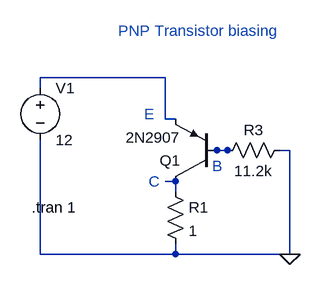
[diagram p0: schematic PNP-transistor-biasing.asc]
PNP-transistor-biasing.asc, the LTspice schematic file:
Version 4.1
SHEET 1 880 680
WIRE 192 208 192 224
WIRE 352 64 368 64
WIRE -16 48 -16 64
WIRE 192 224 368 224
WIRE 368 224 368 64
WIRE 192 224 -16 224
WIRE -16 224 -16 64
FLAG 368 224 0
WIRE 192 16 176 16
WIRE -16 -32 -16 -48
WIRE 176 16 176 -48
WIRE 176 -48 -16 -48
WIRE 256 64 272 64
WIRE 272 64 256 64
WIRE 192 112 176 112
WIRE 192 128 192 112
SYMBOL pnp 256 112 R180
SYMATTR InstName Q1
SYMATTR Value 2N2907
SYMBOL res 176 112 R0
SYMATTR InstName R1
SYMATTR Value 1
SYMBOL res 256 80 R270
WINDOW 0 32 56 VTop 2
WINDOW 3 0 56 VBottom 2
SYMATTR InstName R3
SYMATTR Value 11.2k
SYMBOL voltage -16 -48 R0
WINDOW 123 0 0 Left 2
WINDOW 39 0 0 Left 2
SYMATTR InstName V1
SYMATTR Value 12
TEXT 40 152 Right 2 !.tran 1
TEXT 160 8 Right 2 ;E
TEXT 264 88 Right 2 ;B
TEXT 168 112 Right 2 ;C
TEXT 104 -120 Left 2 ;PNP Transistor biasing

The netlist it stands for:
* PNP-transistor-biasing.asc
Q1 N003 N002 N001 0 2N2907
R1 N003 0 1
R3 N002 0 11.2k
V1 N001 0 12
.model NPN NPN
.model PNP PNP
.lib standard.bjt
.tran 1
* E
* B
* C
* PNP Transistor biasing
.backanno
.end